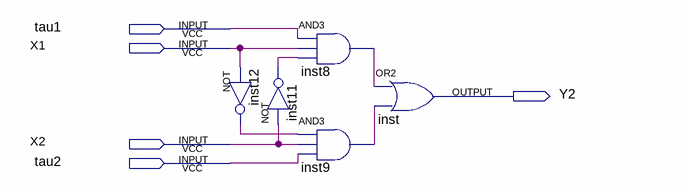
[diagram p0: schematic sheet]
// Quartus schematic Block6.bdf as structural Verilog: 5 symbols, 5 pins
module Block6 (
  input  tau1,
  input  X1,
  input  X2,
  input  tau2,
  output Y2
);

  wire inst8_out, inst9_out, inst11_out, inst12_out;

  not inst12 (inst12_out, X1);
  and inst8 (inst8_out, tau1, X1, inst11_out);
  not inst11 (inst11_out, X2);
  and inst9 (inst9_out, inst12_out, X2, tau2);
  or inst (Y2, inst8_out, inst9_out);
endmodule
